# Altium project Flow_Pump.PrjPcb
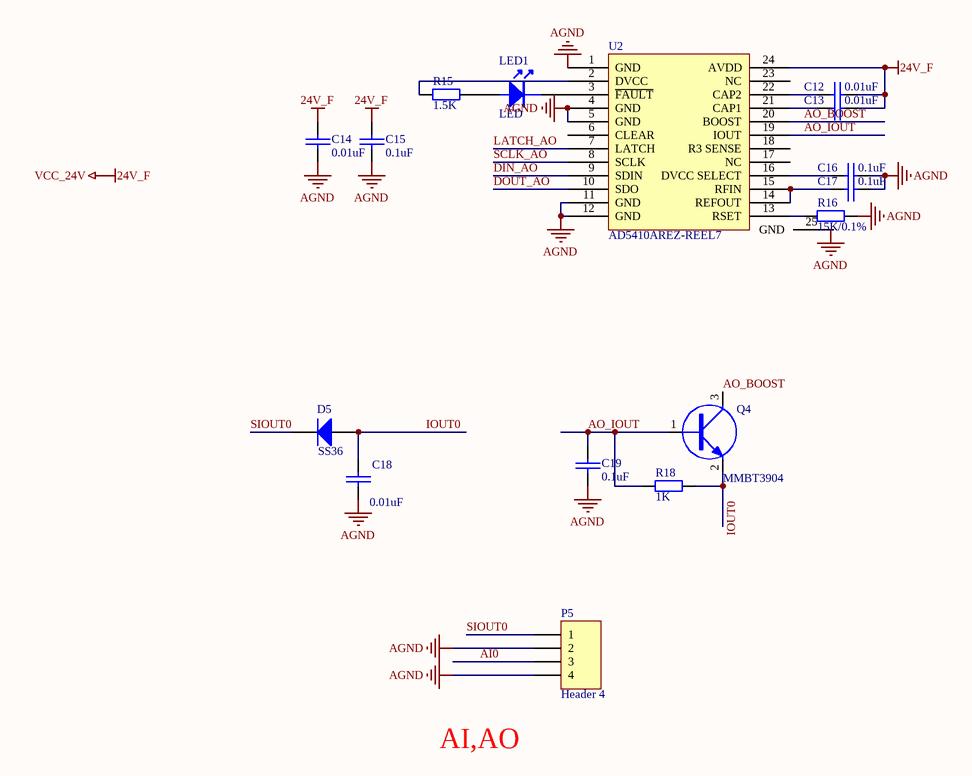
[diagram p0: ao.SchDoc]
4 sheets, 128 parts. Net scope: global (net labels, ports and power ports of the same name join across sheets).
Board files: PCB1.PcbDoc, Flow_Pump.PcbDoc
Sheets:
  ao.SchDoc
  DI_DO.SchDoc
  sensor.SchDoc
  blds.SchDoc

## Sheet ao.SchDoc
size A3; SheetNumber: 2; SheetTotal: 2

### Parts
C12  0.01uF  [0603C]  (no BOM)
C13  0.01uF  [0603C]  (no BOM)
C14  0.01uF  [0603C]  (no BOM)
C15  0.1uF  [0603C]  (no BOM)
C16  0.1uF  [0603C]  (no BOM)
C17  0.1uF  [0603C]  (no BOM)
C18  0.01uF  [0603C]  (no BOM)
C19  0.1uF  [0603C]  (no BOM)
D5  SS36  [sma]  (no BOM)
LED1  LED  [0603LED]  (no BOM)
P5  Header 4  [HDR1X4]
Q4  MMBT3904  [SOT23-3]  (no BOM)
R15  1.5K  [0603R]  (no BOM)
R16  15K/0.1%  [0603R]  (no BOM)
R18  1K  [0603R]  (no BOM)
U2  AD5410AREZ-REEL7  [AD5410AREZ-REEL7]  (no BOM)

### Nets
24V_F: C12.2 C13.2 C14.2 C15.2 U2.24(AVDD)  [also labelled VCC_24V]
AGND: C14.1 C15.1 C16.2 C17.2 C18.1 C19.1 P5.2 P5.4 R16.2 U2.1(GND) U2.4(GND) U2.5(GND) U2.11(GND) U2.12(GND)
AI0: P5.3
AO_BOOST: Q4.3(C) U2.20(BOOST)
AO_IOUT: C19.2 Q4.1(B) R18.1 U2.19(IOUT)
DIN_AO: U2.9(SDIN)
DOUT_AO: U2.10(SDO)
IOUT0: C18.2 D5.1(A) Q4.2(E) R18.2
LATCH_AO: U2.7(LATCH)
SCLK_AO: U2.8(SCLK)
SIOUT0: D5.2(K) P5.1
NetC12_1: C12.1 U2.22(CAP2)
NetC13_1: C13.1 U2.21(CAP1)
NetC16_1: C16.1 U2.16(DVCC_SELECT)
NetC17_1: C17.1 U2.14(REFOUT) U2.15(RFIN)
NetLED1_1: LED1.1 R15.2
NetLED1_2: LED1.2 U2.3(~{FAULT})
NetR15_1: R15.1 U2.2(DVCC)
NetR16_1: R16.1 U2.13(RSET)

Not connected (* = marked no-connect by the designer): U2 6(CLEAR) 17(NC) 18(R3_SENSE) 23(NC) 25(GND)

### Notes on the sheet
- AI,AO
- Labels drawn without touching a wire or pin: AGND

### Library data of the parts
C12-C19 = CAP: Capacitor
D5 = Diode 1N4001: 1 Amp General Purpose Rectifier; Published: 8-Jun-2000; LatestRevisionDate: 17-Jul-2002; LatestRevisionNote: Re-released for DXP Platform.; DatasheetVersion: 1998; PackageVersion: Aug-1999; PackageReference: DO-41; Publisher: Altium Limited; Code_JEDEC: DO-204-AL; ComponentLink1Description: Manufacturer Link; ComponentLink1URL: http://www.fairchildsemi.com/; ComponentLink2Description: Datasheet; ComponentLink2URL: http://www.fairchildsemi.com/ds/1N%2F1N4001.pdf
P5 = Header 4: Header, 4-Pin; LatestRevisionDate: 17-Jul-2002; LatestRevisionNote: Re-released for DXP Platform.; Publisher: Altium Limited
Q4 = NPN_MMBT3904
R15 R16 R18 = Res0805M

## Sheet DI_DO.SchDoc
size A3; SheetNumber: 4; SheetTotal: 4
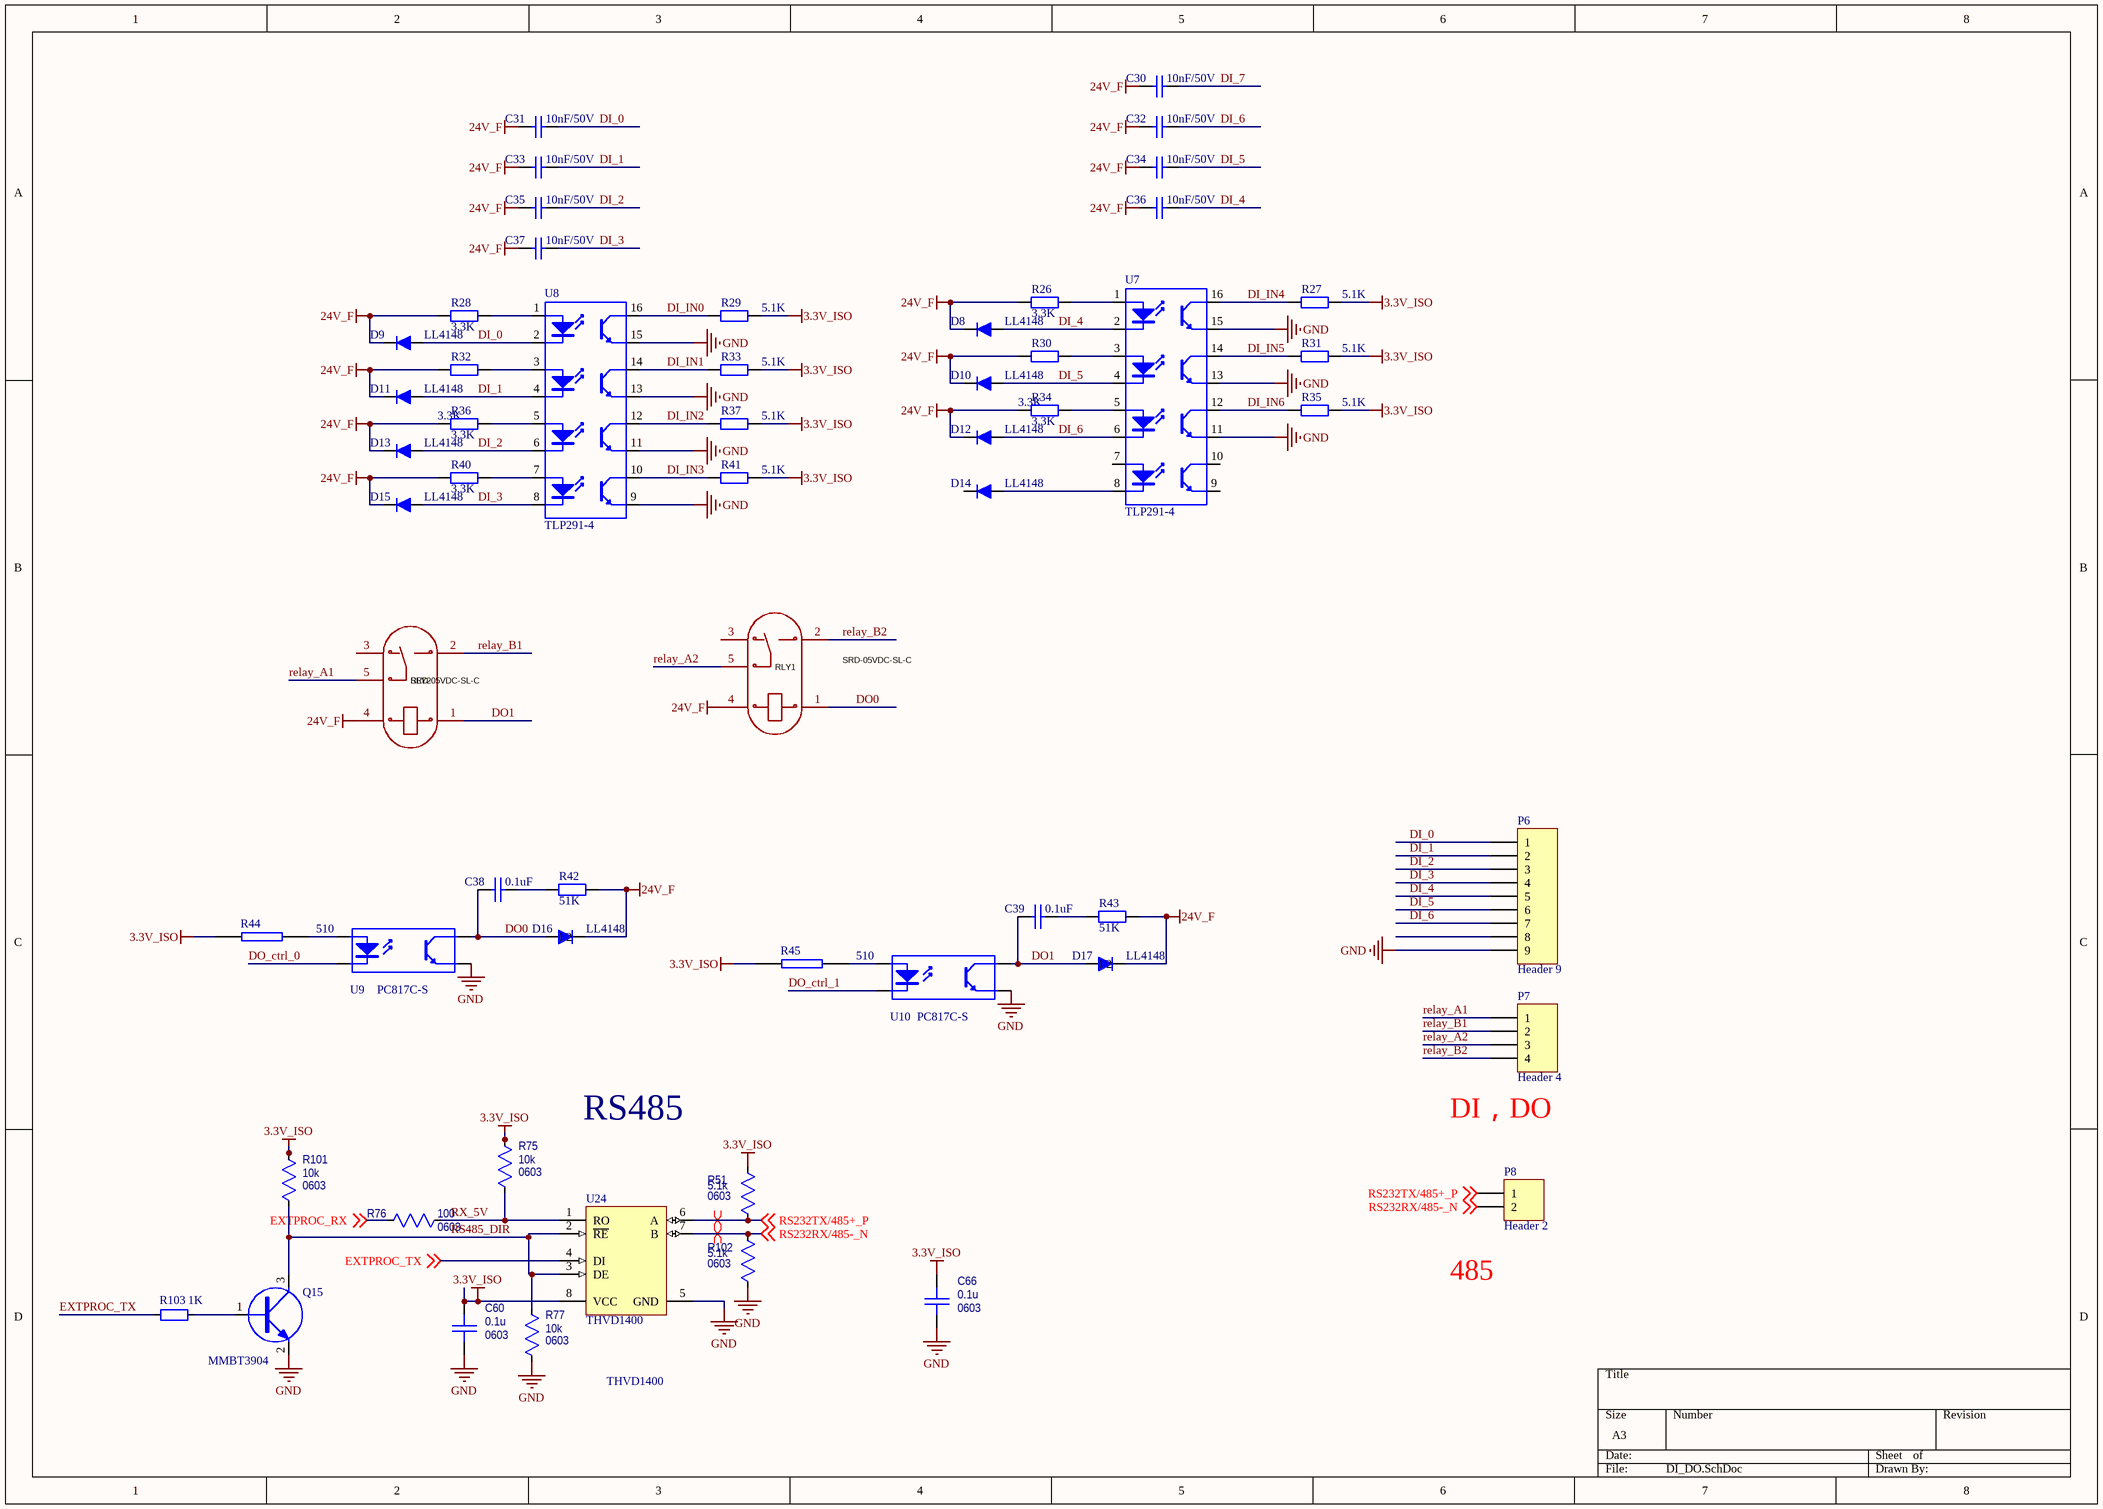
[diagram p1: DI_DO.SchDoc]

### Parts
C30  10nF/50V  [0603C]
C31  10nF/50V  [0603C]
C32  10nF/50V  [0603C]
C33  10nF/50V  [0603C]
C34  10nF/50V  [0603C]
C35  10nF/50V  [0603C]
C36  10nF/50V  [0603C]
C37  10nF/50V  [0603C]
C38  0.1uF  [0603C]
C39  0.1uF  [0603C]
C60  value 0.1u  Package: 0603  [CAPC1608X092N_0603]  (hidden comment: Capacitor_0603)
C66  value 0.1u  Package: 0603  [CAPC1608X092N_0603]  (hidden comment: Capacitor_0603)
D8  LL4148  [DO-213AB/LL34/MiniMELF]
D9  LL4148  [DO-213AB/LL34/MiniMELF]
D10  LL4148  [DO-213AB/LL34/MiniMELF]
D11  LL4148  [DO-213AB/LL34/MiniMELF]
D12  LL4148  [DO-213AB/LL34/MiniMELF]
D13  LL4148  [DO-213AB/LL34/MiniMELF]
D14  LL4148  [DO-213AB/LL34/MiniMELF]
D15  LL4148  [DO-213AB/LL34/MiniMELF]
D16  LL4148  [DO-213AB/LL34/MiniMELF]
D17  LL4148  [DO-213AB/LL34/MiniMELF]
P6  Header 9  [HDR1X9]
P7  Header 4  [HDR1X4]
P8  Header 2  [HDR1X2]
Q15  MMBT3904  [SOT23-3]
R26  3.3K  [0603R]
R27  5.1K  [0603R]
R28  3.3K  [0603R]
R29  5.1K  [0603R]
R30  3.3K  [0603R]
R31  5.1K  [0603R]
R32  3.3K  [0603R]
R33  5.1K  [0603R]
R34  3.3K  [0603R]
R35  5.1K  [0603R]
R36  3.3K  [0603R]
R37  5.1K  [0603R]
R40  3.3K  [0603R]
R41  5.1K  [0603R]
R42  51K  [0603R]
R43  51K  [0603R]
R44  510  [0603R]
R45  510  [0603R]
R51  value 5.1k  Package: 0603  [0603r]  (hidden comment: 10k)
R75  value 10k  Package: 0603  [RESC1608X055N_0603]  (hidden comment: Resistor_0603)
R76  value 100  Package: 0603  [RESC1608X055N_0603]  (hidden comment: Resistor_0603)
R77  value 10k  Package: 0603  [RESC1608X055N_0603]  (hidden comment: Resistor_0603)
R101  value 10k  Package: 0603  [RESC1608X055N_0603]  (hidden comment: Resistor_0603)
R102  value 5.1k  Package: 0603  [0603r]  (hidden comment: 10k)
R103  1K  [0603r]
RLY1  SRD-05VDC-SL-C  [RELAY-TH_SRD-XXVDC-XL-C]
RLY2  SRD-05VDC-SL-C  [RELAY-TH_SRD-XXVDC-XL-C]
U7  TLP291-4  [SOP16-T]
U8  TLP291-4  [SOP16-T]
U9  PC817C-S  [sop4]
U10  PC817C-S  [sop4]
U24  THVD1400  [MAXM-S8+4_M]

### Nets
3.3V_ISO: C60.1 C66.1 R27.1 R29.1 R31.1 R33.1 R35.1 R37.1 R41.1 R44.2 R45.2 R51.1 R75.2 R101.2 U24.8(VCC)
24V_F: C30.1 C31.1 C32.1 C33.1 C34.1 C35.1 C36.1 C37.1 D8.2 D9.2 D10.2 D11.2 D12.2 D13.2 D15.2 D16.2(1) D17.2(1) R26.2 R28.2 R30.2 R32.2 R34.2 R36.2 R40.2 R42.2 R43.2 RLY1.4 RLY2.4
GND: C60.2 C66.2 P6.9 Q15.2(E) R77.1 R102.2 U7.11(E) U7.13(E) U7.15(E) U8.9(E) U8.11(E) U8.13(E) U8.15(E) U9.3(E) U10.3(E) U24.5(GND)
DI_0: C31.2 D9.1 P6.1 U8.2(K)
DI_1: C33.2 D11.1 P6.2 U8.4(K)
DI_2: C35.2 D13.1 P6.3 U8.6(K)
DI_3: C37.2 D15.1 P6.4 U8.8(K)
DI_4: C36.2 D8.1 P6.5 U7.2(K)
DI_5: C34.2 D10.1 P6.6 U7.4(K)
DI_6: C32.2 D12.1 P6.7 U7.6(K)
DI_7: C30.2
DI_IN0: R29.2 U8.16(C)
DI_IN1: R33.2 U8.14(C)
DI_IN2: R37.2 U8.12(C)
DI_IN3: R41.2 U8.10(C)
DI_IN4: R27.2 U7.16(C)
DI_IN5: R31.2 U7.14(C)
DI_IN6: R35.2 U7.12(C)
DO0: C38.1 D16.1(2) RLY1.1 U9.4(C)
DO1: C39.1 D17.1(2) RLY2.1 U10.4(C)
DO_ctrl_0: U9.2(K)
DO_ctrl_1: U10.2(K)
EXTPROC_RX: R76.2 ; off-sheet EXTPROC_RX
EXTPROC_TX: R103.1 U24.4(DI) ; off-sheet EXTPROC_TX
relay_A1: P7.1 RLY2.5
relay_A2: P7.3 RLY1.5
relay_B1: P7.2 RLY2.2
relay_B2: P7.4 RLY1.2
RS232RX/485-_N: P8.2 R102.1 U24.7(B) ; off-sheet RS232RX/485-_N
RS232TX/485+_P: P8.1 R51.2 U24.6(A) ; off-sheet RS232TX/485+_P
RS485_DIR: Q15.3(C) R77.2 R101.1 U24.2(~{RE}) U24.3(DE)
RX_5V: R75.1 R76.1 U24.1(RO)
NetC38_2: C38.2 R42.1
NetC39_2: C39.2 R43.1
NetD14_1: D14.1 U7.8(K)
NetQ15_1: Q15.1(B) R103.2
NetR26_1: R26.1 U7.1(A)
NetR28_1: R28.1 U8.1(A)
NetR30_1: R30.1 U7.3(A)
NetR32_1: R32.1 U8.3(A)
NetR34_1: R34.1 U7.5(A)
NetR36_1: R36.1 U8.5(A)
NetR40_1: R40.1 U8.7(A)
NetR44_1: R44.1 U9.1(A)
NetR45_1: R45.1 U10.1(A)

Not connected (* = marked no-connect by the designer): D14 2(1); P6 8; RLY1 3; RLY2 3; U7 7(A) 9(E) 10(C)

### Layout directives
differential pair: RS232RX/485-_N, RS232TX/485+_P

### Notes on the sheet
- RS485
- (near P7) DI，DO
- (near P8) 485
- THVD1400

### Library data of the parts
C30-C37 = Cap: Capacitor; Value: 22nF; Published: 8-Jun-2000; LatestRevisionDate: 17-Jul-2002; LatestRevisionNote: Re-released for DXP Platform.; PackageReference: RAD-0.3; Publisher: Altium Limited; PackageDescription: Radial Cap, Thru-Hole; 2 Leads; 0.3 in Pin Spacing
C38 C39 = CAP: Capacitor
C60 C66 = Capacitor_0603: Capacitor, MLCC; PartNumber: C0603C104M5RACTU; Tolerance: [tol]; TempCo: [tempco]; Voltage Rating: [voltage]; ComponentLink1URL: *; ComponentLink1Description: Datasheet; SupplierDescription: CAP CER 0.1UF 50V X7R 0603
D8-D17 = LL4148: VISHAY,LL4148,圆柱体MiniMELF100V/2A,ROHS; 版本: V1.00; 名称: 快速开关二极管; 物料编号: APLLY; 制造商: VISHAY
P6 = Header 9: Header, 9-Pin; LatestRevisionDate: 17-Jul-2002; LatestRevisionNote: Re-released for DXP Platform.; Publisher: Altium Limited
P7 = Header 4: Header, 4-Pin; LatestRevisionDate: 17-Jul-2002; LatestRevisionNote: Re-released for DXP Platform.; Publisher: Altium Limited
P8 = Header 2: Header, 2-Pin; LatestRevisionDate: 17-Jul-2002; LatestRevisionNote: Re-released for DXP Platform.; Publisher: Altium Limited
Q15 = NPN_MMBT3904
R26-R37 R40-R43 = Res0805M
R44 R45 = RES2
R51 R102 = Resistor_0603: PartNumber: RC0603FR-071KL; Power Rating: [power]; TempCo: [tempco]; Tolerance: tol; SupplierDescription: RES SMD 1K OHM 1% 1/10W 0603
R75 R77 R101 = Resistor_0603: Resistor, Standard; PartNumber: RC0603FR-0710KL; TempCo: [tempco]; Tolerance: tol; ComponentLink1URL: *; ComponentLink1Description: Datasheet; SupplierDescription: RES SMD 10K OHM 1% 1/10W 0603
R76 = Resistor_0603: Resistor, Standard; PartNumber: RC0603FR-07100RL; TempCo: [tempco]; Tolerance: tol; ComponentLink1URL: *; ComponentLink1Description: Datasheet; SupplierDescription: RES SMD 100 OHM 1% 1/10W 0603
R103 = RES0603: 物料主编码(PN): 150000040; ID: 233; 序号: 109; 物料名称: 贴片电阻; 精度: ±1%; 规格型号(完整型号): RC1608F103CS/RC0603FR-0710KL; 物料描述: RES,贴片电阻,0603,10k,±1%,1/10W,1.6X0.8X0.45mm,RC1608F103CS/RC0603FR-0710KL; 工作温度: –55°C to 155°C; 制造商: 三星/YAGEO; 器件等级: ——; 物料类型: 表贴电阻; 参数值: 1.00E+04; Value: 1K
RLY1 RLY2 = SRD-05VDC-SL-C: Manufacturer: 松乐; Add into BOM: yes; Coil Voltage: 5V; Contact Form: 一组转换:1C(单刀双掷-转换); Pin Number: 5; Maximum Switching Voltage: 250V@AC; Coil Rated Power: 360mW; Maximum Switching Current: 15A; Coil Type: 无极性-单线圈; Coil Resistance: 70Ω; Contact Resistance: 100mΩ; Operate Time: 10ms; Symbol: SRD-05VDC-SL-C; Device: SRD-05VDC-SL-C; LCSC Part Name: 蓝色; Supplier Part: C35449; Manufacturer Part: SRD-05VDC-SL-C; Supplier Footprint: 插件,15.6x19.2mm; JLCPCB Part Class: Extended Part; Datasheet: https://atta.szlcsc.com/upload/public/pdf/source/20200305/C490149_C96E4098A3B1FFB377D5AD2E40B7C2A8.pdf; Supplier: LCSC; Convert to PCB: yes; Contact Rating: -; Release Time: 10ms
U7 U8 = TLP281-4
U9 U10 = Optoisolator1: 4-Pin Phototransistor Optocoupler; Published: 24-Mar-1999; LatestRevisionDate: 04-Mar-2005; LatestRevisionNote: Sch pins 3 & 4 Swapped.; DatasheetVersion: Nov-2003; PackageReference: DIP-4; Publisher: Altium Limited
U24 = MAX33071EASA+: RS-485 Half-Duplex Transceiver with ±65V Fault Protection,+3V to +5.5V, -40 to 125 degC, 8-Pin SOIC (S8+4), RoHS, Tube; VOUT: 3.000 V; VIN: 3.2 to 12.6 V; PartNumber: MAX33071EASA+; ComponentLink1URL: http://www.maximintegrated.com/; ComponentLink1Description: Manufacturer URL; ComponentLink2URL: https://datasheets.maximintegrated.com/en/ds/MAX33070E-MAX33071E.pdf; ComponentLink2Description: Datasheet; Value: MAX33071EASA+

## Sheet sensor.SchDoc
size A3
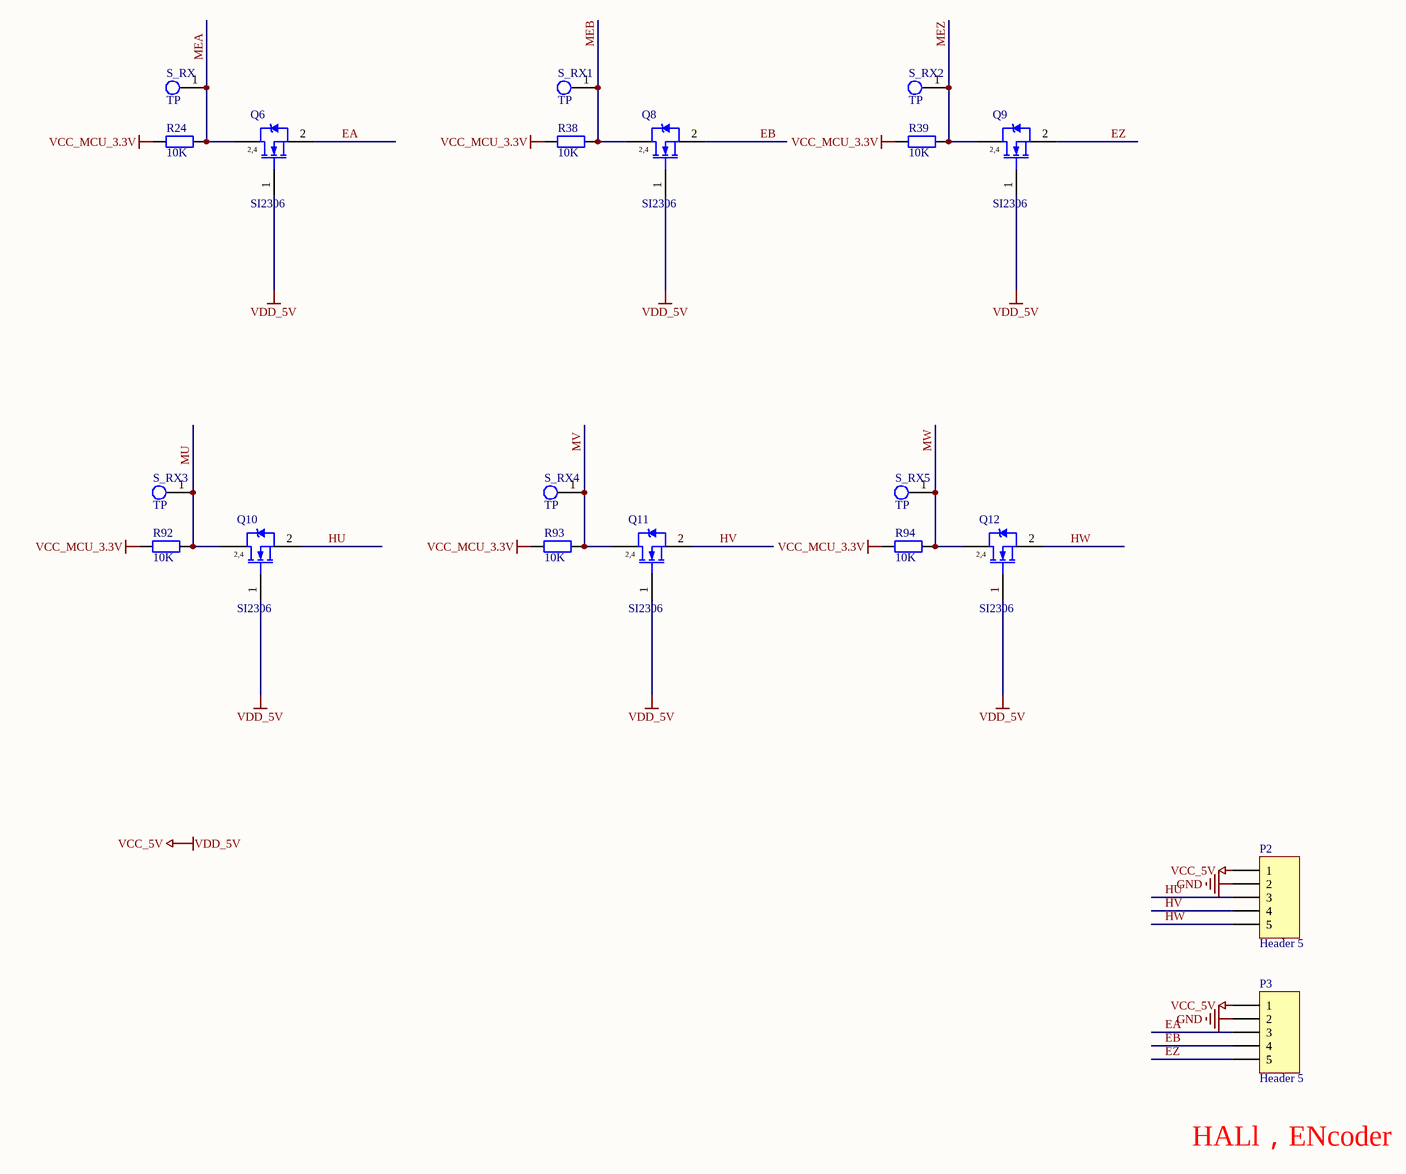
[diagram p2: sensor.SchDoc]

### Parts
P2  Header 5  [HDR1X5]
P3  Header 5  [HDR1X5]
Q6  SI2306  [SOT23-3]
Q8  SI2306  [SOT23-3]
Q9  SI2306  [SOT23-3]
Q10  SI2306  [SOT23-3]
Q11  SI2306  [SOT23-3]
Q12  SI2306  [SOT23-3]
R24  10K  [0603R]
R38  10K  [0603R]
R39  10K  [0603R]
R92  10K  [0603R]
R93  10K  [0603R]
R94  10K  [0603R]
S_RX  TP  [TPD]
S_RX1  TP  [TPD]
S_RX2  TP  [TPD]
S_RX3  TP  [TPD]
S_RX4  TP  [TPD]
S_RX5  TP  [TPD]

### Nets
GND: P2.2 P3.2
VCC_5V: P2.1 P3.1 Q6.1(G) Q8.1(G) Q9.1(G) Q10.1(G) Q11.1(G) Q12.1(G)  [also labelled VDD_5V]
VCC_MCU_3.3V: R24.1 R38.1 R39.1 R92.1 R93.1 R94.1
EA: P3.3 Q6.2(S)
EB: P3.4 Q8.2(S)
EZ: P3.5 Q9.2(S)
HU: P2.3 Q10.2(S)
HV: P2.4 Q11.2(S)
HW: P2.5 Q12.2(S)
MEA: Q6.3(D) R24.2 S_RX.1
MEB: Q8.3(D) R38.2 S_RX1.1
MEZ: Q9.3(D) R39.2 S_RX2.1
MU: Q10.3(D) R92.2 S_RX3.1
MV: Q11.3(D) R93.2 S_RX4.1
MW: Q12.3(D) R94.2 S_RX5.1

### Notes on the sheet
- HALl，ENcoder
- (in symbol BUK92150-55A) 2,4

### Library data of the parts
P2 P3 = Header 5: Header, 5-Pin; LatestRevisionDate: 17-Jul-2002; LatestRevisionNote: Re-released for DXP Platform.; Publisher: Altium Limited
Q6 Q8-Q12 = BUK92150-55A: Published: 8-Jun-2000; LatestRevisionDate: 17-Jul-2002; LatestRevisionNote: Re-released for DXP Platform.; DatasheetVersion: 6-Oct-1997; PackageVersion: Aug-1998; PackageReference: TSOP-6; Publisher: Altium Limited; PackageDescription: SOT-457/SC-74; 6 Leads; Body 3.1 x 3 mm, inc. leads (LxW max); ComponentLink1Description: Manufacturer Link; ComponentLink1URL: http://www.vishay.com/; ComponentLink2Description: Datasheet; ComponentLink2URL: http://www.vishay.com/docs/70192/70192.pdf
R24 R38 R39 R92-R94 = Res2: Resistor; Value: 10R; Published: 8-Jun-2000; LatestRevisionDate: 17-Jul-2002; LatestRevisionNote: Re-released for DXP Platform.; PackageReference: AXIAL-0.4; Publisher: Altium Limited

## Sheet blds.SchDoc
size A2
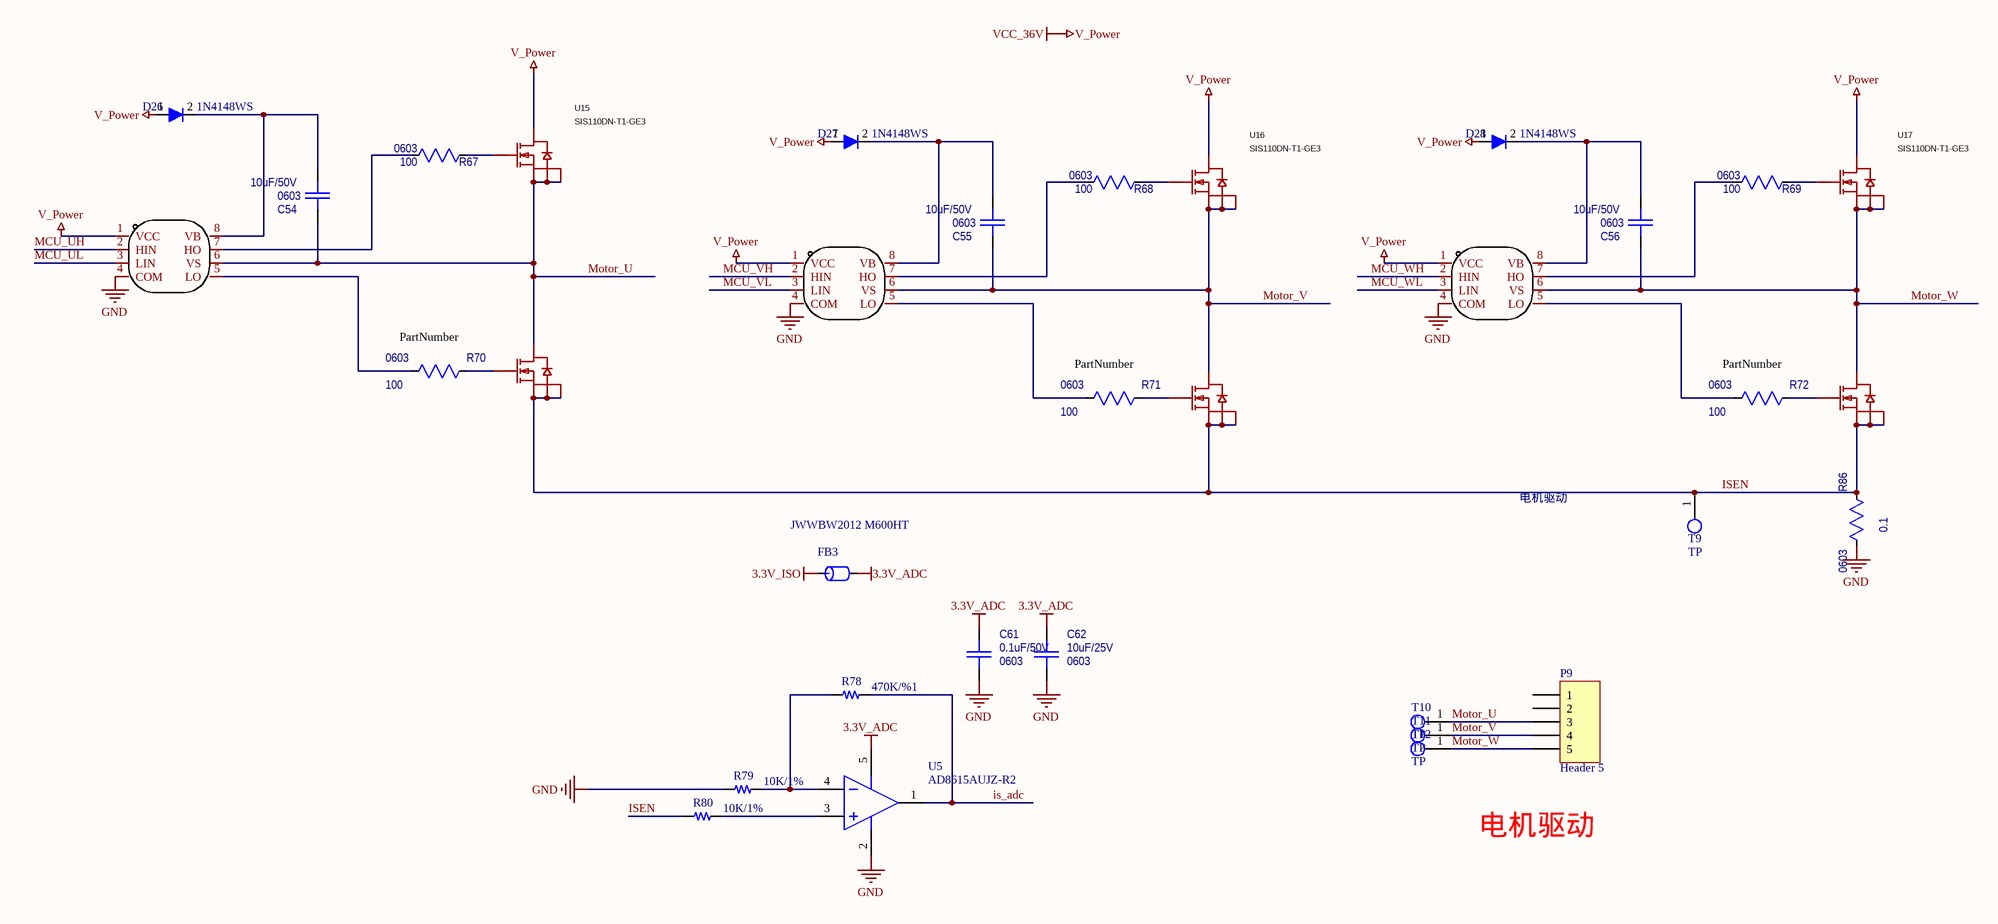
[diagram p3: blds.SchDoc]

### Parts
C54  10uF/50V  Package: 0603  [CAPC1608X092N_0603]
C55  10uF/50V  Package: 0603  [CAPC1608X092N_0603]
C56  10uF/50V  Package: 0603  [CAPC1608X092N_0603]
C61  value 0.1uF/50V  Package: 0603  [CAPC1608X092N_0603]  (hidden comment: Capacitor_0603)
C62  value 10uF/25V  Package: 0603  [CAPC1608X092N_0603]  (hidden comment: Capacitor_0603)
D26  1N4148WS  [SOD323]
D27  1N4148WS  [SOD323]
D28  1N4148WS  [SOD323]
FB3  JWWBW2012 M600HT  [0805R]
P9  Header 5  [HDR1X5]
R67  value 100  Package: 0603  [RESC1608X055N_0603]  (hidden comment: Resistor_0603)
R68  value 100  Package: 0603  [RESC1608X055N_0603]  (hidden comment: Resistor_0603)
R69  value 100  Package: 0603  [RESC1608X055N_0603]  (hidden comment: Resistor_0603)
R70  value 100  Package: 0603  [RESC1608X055N_0603]  (hidden comment: Resistor_0603)
R71  value 100  Package: 0603  [RESC1608X055N_0603]  (hidden comment: Resistor_0603)
R72  value 100  Package: 0603  [RESC1608X055N_0603]  (hidden comment: Resistor_0603)
R78  value 470K/%1  [0603R]
R79  value 10K/1%  [0603R]
R80  value 10K/1%  [0603R]
R86  Package: 0603  [2010R]  (hidden comment: 0.1)
T9  TP  [TPD]
T10  TP  [TPD]
T11  TP  [TPD]
T12  TP  [TPD]
U5  AD8615AUJZ-R2  [sot-23-5]
U15  SIS110DN-T1-GE3  [DFN-8_L3.3-W3.3-P0.65-BL-2]
U16  SIS110DN-T1-GE3  [DFN-8_L3.3-W3.3-P0.65-BL-2]
U17  SIS110DN-T1-GE3  [DFN-8_L3.3-W3.3-P0.65-BL-2]
U18  IRS21867STRPBF  [SO-8]  (value not drawn)
U19  IRS21867STRPBF  [SO-8]  (value not drawn)
U20  IRS21867STRPBF  [SO-8]  (value not drawn)
U21  SIS110DN-T1-GE3  [DFN-8_L3.3-W3.3-P0.65-BL-2]  (value not drawn)
U22  SIS110DN-T1-GE3  [DFN-8_L3.3-W3.3-P0.65-BL-2]  (value not drawn)
U23  SIS110DN-T1-GE3  [DFN-8_L3.3-W3.3-P0.65-BL-2]  (value not drawn)

### Nets
3.3V_ADC: C61.1 C62.1 FB3.2 U5.5(VCC)
3.3V_ISO: FB3.1
GND: C61.2 C62.2 R79.2 R86.1 U5.2(G) U18.4(COM) U19.4(COM) U20.4(COM)
V_Power: D26.1(K) D27.1(K) D28.1(K) U15.5(D) U16.5(D) U17.5(D) U18.1(VCC) U19.1(VCC) U20.1(VCC)  [also labelled VCC_36V]
is_adc: R78.1 U5.1(OS_NUL)
ISEN: R80.2 R86.2 T9.1 U21.1(S) U21.2(S) U21.3(S) U22.1(S) U22.2(S) U22.3(S) U23.1(S) U23.2(S) U23.3(S)
MCU_UH: U18.2(HIN)
MCU_UL: U18.3(LIN)
MCU_VH: U19.2(HIN)
MCU_VL: U19.3(LIN)
MCU_WH: U20.2(HIN)
MCU_WL: U20.3(LIN)
Motor_U: C54.1 P9.3 T10.1 U15.1(S) U15.2(S) U15.3(S) U18.6(VS) U21.5(D)
Motor_V: C55.1 P9.4 T11.1 U16.1(S) U16.2(S) U16.3(S) U19.6(VS) U22.5(D)
Motor_W: C56.1 P9.5 T12.1 U17.1(S) U17.2(S) U17.3(S) U20.6(VS) U23.5(D)
NetC54_2: C54.2 D26.2(A) U18.8(VB)
NetC55_2: C55.2 D27.2(A) U19.8(VB)
NetC56_2: C56.2 D28.2(A) U20.8(VB)
NetR67_1: R67.1 U18.7(HO)
NetR67_2: R67.2 U15.4(G)
NetR68_1: R68.1 U19.7(HO)
NetR68_2: R68.2 U16.4(G)
NetR69_1: R69.1 U20.7(HO)
NetR69_2: R69.2 U17.4(G)
NetR70_1: R70.1 U18.5(LO)
NetR70_2: R70.2 U21.4(G)
NetR71_1: R71.1 U19.5(LO)
NetR71_2: R71.2 U22.4(G)
NetR72_1: R72.1 U20.5(LO)
NetR72_2: R72.2 U23.4(G)
NetR78_2: R78.2 R79.1 U5.4(V-)
NetR80_1: R80.1 U5.3(V+)

Not connected (* = marked no-connect by the designer): P9 1 2

### Notes on the sheet
- (near R70) PartNumber
- (near R71) PartNumber
- (near R72) PartNumber
- 电机驱动

### Library data of the parts
C54-C56 = Capacitor_0603: Capacitor, MLCC; Manufacturer: muRata; PartNumber: GQM2195C2E4R7CB12J; Tolerance: [tol]; TempCo: [tempco]; Voltage Rating: [voltage]; Value: 4.7pF; ComponentLink1URL: *; Current Rating: *; ComponentLink1Description: Datasheet; Power Rating: *; SupplierDescription: CAP CER 1nF 50V X7R 0603
C61 C62 = Capacitor_0603: PartNumber: C0603C104M5RACTU; Tolerance: [tol]; TempCo: [tempco]; Voltage Rating: [voltage]; Supplier 1: *; Supplier Part Number 1: *; SupplierDescription: CAP CER 0.1UF 50V X7R 0603
D26-D28 = LL4148: 版本: V1.00; 名称: 快速开关二极管; 物料编号: APLLY; 制造商: VISHAY; Value: LL4148
FB3 = FB: Part Field 1: 磁珠/0603/1K ohm/100MHz; FB: BLM18BD102SN1(muRata); Text Field1: FB
P9 = Header 5: Header, 5-Pin; LatestRevisionDate: 17-Jul-2002; LatestRevisionNote: Re-released for DXP Platform.; Publisher: Altium Limited
R67-R72 R86 = Resistor_0603: Resistor, Standard; Manufacturer: Yageo; PartNumber: RC0603FR-0710KL; Power Rating: [power]; TempCo: [tempco]; Tolerance: tol; ComponentLink1URL: *; ComponentLink1Description: Datasheet; SupplierDescription: RES SMD 10K OHM 1% 1/10W 0603
  R86: Value: 0.1
R78-R80 = R
U5 = AD8615: Value: AD8615AUJZ-R2
U15-U17 U21-U23 = SIS110DN-T1-GE3: Manufacturer: VISHAY(威世); Add into BOM: yes; Symbol: SIS110DN-T1-GE3; Device: SIS110DN-T1-GE3; LCSC Part Name: SIS110DN-T1-GE3; Supplier Part: C5334354; Manufacturer Part: SIS110DN-T1-GE3; Supplier Footprint: SO-8; JLCPCB Part Class: Extended Part; Datasheet: https://atta.szlcsc.com/upload/public/pdf/source/20221230/028E61738915F263ABF2615161A8D7B6.pdf; Supplier: LCSC; Convert to PCB: yes
U18-U20 = IRS21867STRPBF: Manufacturer: Infineon(英飞凌); Add into BOM: yes; Driven Configuration: 半桥; Load Type: MOSFET；IGBT; Number of Drivers: 2; Peak Output Current(sink): 4A; Supply Voltage: 10V~20V; Rise Time: 22ns; Fall Time: 18ns; Symbol: IRS21867STRPBF; Device: IRS21867STRPBF; LCSC Part Name: IRS21867STRPBF; Supplier Part: C52290; Manufacturer Part: IRS21867STRPBF; Supplier Footprint: SOIC-8; JLCPCB Part Class: Extended Part; Datasheet: https://atta.szlcsc.com/upload/public/pdf/source/20161024/1477287953380.pdf; Supplier: LCSC; Convert to PCB: yes; Peak Output Current(source): 4A; Operating Temperature: -40℃~+150℃@(Tj)

## Nets that join several sheets
3.3V_ISO: DI_DO (15 pins), blds (FB3.1)
24V_F: ao (5 pins), DI_DO (28 pins)
GND: DI_DO (16 pins), sensor (P2.2 P3.2), blds (8 pins)